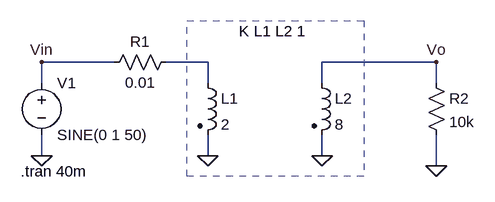
[diagram p0: schematic Model Transformer in LTspice.asc]
Model Transformer in LTspice.asc, the LTspice schematic file:
Version 4
SHEET 1 880 680
WIRE 16 96 -96 96
WIRE 160 96 96 96
WIRE 512 96 336 96
WIRE -96 128 -96 96
WIRE 160 128 160 96
WIRE 336 128 336 96
WIRE 512 128 512 96
WIRE -96 240 -96 208
WIRE 160 240 160 208
WIRE 336 240 336 208
WIRE 512 256 512 208
FLAG 336 240 0
FLAG 160 240 0
FLAG -96 240 0
FLAG 512 96 Vo
FLAG -96 96 Vin
FLAG 512 256 0
SYMBOL ind2 144 112 R0
SYMATTR InstName L1
SYMATTR Value 2
SYMATTR Type ind
SYMBOL ind2 320 112 R0
SYMATTR InstName L2
SYMATTR Value 8
SYMATTR Type ind
SYMBOL res 112 80 R90
WINDOW 0 0 56 VBottom 2
WINDOW 3 32 56 VTop 2
SYMATTR InstName R1
SYMATTR Value 0.01
SYMBOL voltage -96 112 R0
WINDOW 123 0 0 Left 0
WINDOW 39 0 0 Left 0
SYMATTR InstName V1
SYMATTR Value SINE(0 1 50)
SYMBOL res 496 112 R0
SYMATTR InstName R2
SYMATTR Value 10k
TEXT -128 264 Left 2 !.tran 40m
TEXT 208 48 Left 2 !K L1 L2 1
RECTANGLE Normal 400 272 128 32 1

The netlist it stands for:
* Model Transformer in LTspice.asc
L1 N001 0 2
L2 Vo 0 8
R1 N001 Vin 0.01
V1 Vin 0 SINE(0 1 50)
R2 Vo 0 10k
.tran 40m
K L1 L2 1
.backanno
.end